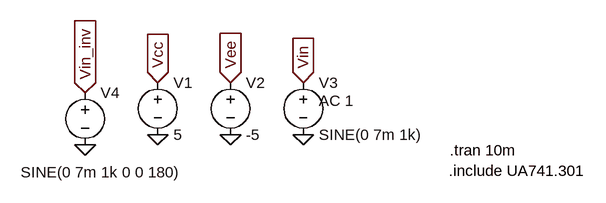
[diagram p0: schematic small_signal_model.asc]
small_signal_model.asc, the LTspice schematic file:
Version 4
SHEET 1 1296 728
FLAG -528 -304 0
FLAG -416 -304 0
FLAG -528 -384 Vcc
IOPIN -528 -384 In
FLAG -416 -384 Vee
IOPIN -416 -384 In
FLAG -304 -304 0
FLAG -304 -384 Vin
IOPIN -304 -384 In
FLAG -640 -288 0
FLAG -640 -368 Vin_inv
IOPIN -640 -368 In
SYMBOL voltage -528 -400 R0
WINDOW 123 0 0 Left 0
WINDOW 39 0 0 Left 0
SYMATTR InstName V1
SYMATTR Value 5
SYMBOL voltage -416 -400 R0
WINDOW 123 0 0 Left 0
WINDOW 39 0 0 Left 0
SYMATTR InstName V2
SYMATTR Value -5
SYMBOL voltage -304 -400 R0
WINDOW 123 24 44 Left 2
WINDOW 39 0 0 Left 0
SYMATTR Value2 AC 1
SYMATTR InstName V3
SYMATTR Value SINE(0 7m 1k)
SYMBOL voltage -640 -384 R0
WINDOW 3 -99 138 Left 2
WINDOW 123 0 0 Left 0
WINDOW 39 0 0 Left 0
SYMATTR Value SINE(0 7m 1k 0 0 180)
SYMATTR InstName V4
TEXT -80 -248 Left 2 !.include UA741.301
TEXT -78 -280 Left 2 !.tran 10m

The netlist it stands for:
* small_signal_model.asc
V1 Vcc 0 5
V2 Vee 0 -5
V3 Vin 0 SINE(0 7m 1k) AC 1
V4 Vin_inv 0 SINE(0 7m 1k 0 0 180)
.include UA741.301
.tran 10m
.backanno
.end